# EAGLE schematic hw_Stencil_IMX296 (EAGLE 7.6.0)
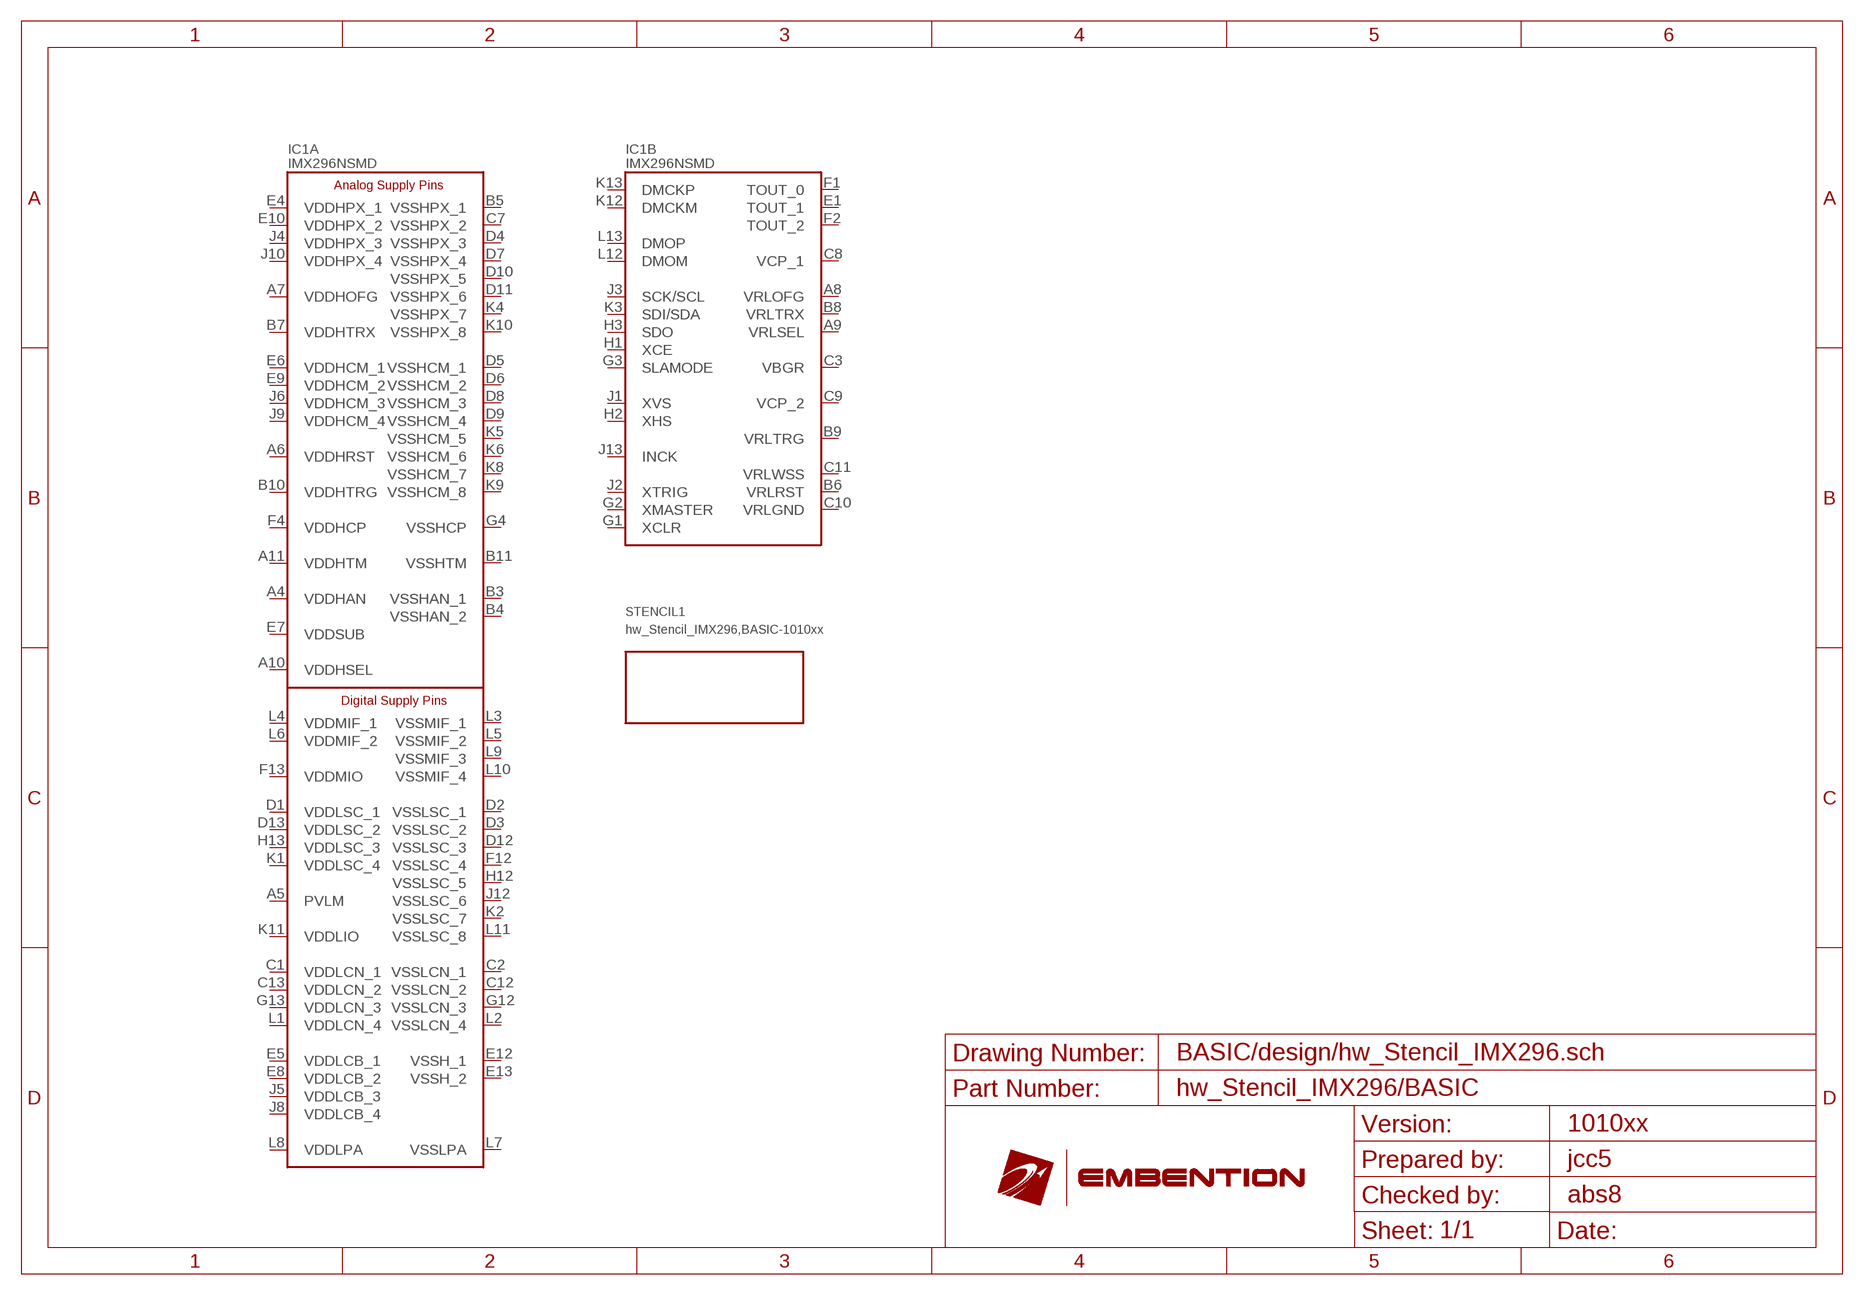
[diagram p0: schematic, sheet 1]

## Parts
IC1  IMX296NSMD  [LGA-138_NSMD]
STENCIL1  hw_Stencil_IMX296,BASIC-1010xx  EXTERNAL-PCB-COMPONENTS  [VOID]
Unconnected: IC1.A1(C:NC_1) IC1.A3(C:NC_2) IC1.A4(A:VDDHAN) IC1.A5(A:PVLM) IC1.A6(A:VDDHRST) IC1.A7(A:VDDHOFG) IC1.A8(B:VRLOFG) IC1.A9(B:VRLSEL) IC1.A10(A:VDDHSEL) IC1.A11(A:VDDHTM) IC1.A13(C:NC_3) IC1.B3(A:VSSHAN_1) IC1.B4(A:VSSHAN_2) IC1.B5(A:VSSHPX_1) IC1.B6(B:VRLRST) IC1.B7(A:VDDHTRX) IC1.B8(B:VRLTRX) IC1.B9(B:VRLTRG) IC1.B10(A:VDDHTRG) IC1.B11(A:VSSHTM) IC1.C1(A:VDDLCN_1) IC1.C2(A:VSSLCN_1) IC1.C3(B:VBGR) IC1.C4(C:NC_4) IC1.C5(C:NC_5) IC1.C6(C:NC_6) IC1.C7(A:VSSHPX_2) IC1.C8(B:VCP_1) IC1.C9(B:VCP_2) IC1.C10(B:VRLGND) IC1.C11(B:VRLWSS) IC1.C12(A:VSSLCN_2) IC1.C13(A:VDDLCN_2) IC1.D1(A:VDDLSC_1) IC1.D2(A:VSSLSC_1) IC1.D3(A:VSSLSC_2) IC1.D4(A:VSSHPX_3) IC1.D5(A:VSSHCM_1) IC1.D6(A:VSSHCM_2) IC1.D7(A:VSSHPX_4) IC1.D8(A:VSSHCM_3) IC1.D9(A:VSSHCM_4) IC1.D10(A:VSSHPX_5) IC1.D11(A:VSSHPX_6) IC1.D12(A:VSSLSC_3) IC1.D13(A:VDDLSC_2) IC1.E1(B:TOUT_1) IC1.E2(C:NC_7) IC1.E3(C:NC_8) IC1.E4(A:VDDHPX_1) IC1.E5(A:VDDLCB_1) IC1.E6(A:VDDHCM_1) IC1.E7(A:VDDSUB) IC1.E8(A:VDDLCB_2) IC1.E9(A:VDDHCM_2) IC1.E10(A:VDDHPX_2) IC1.E11(C:NC_9) IC1.E12(A:VSSH_1) IC1.E13(A:VSSH_2) IC1.F1(B:TOUT_0) IC1.F2(B:TOUT_2) IC1.F3(C:NC_10) IC1.F4(A:VDDHCP) IC1.F10(C:NC_11) IC1.F11(C:NC_12) IC1.F12(A:VSSLSC_4) IC1.F13(A:VDDMIO) IC1.G1(B:XCLR) IC1.G2(B:XMASTER) IC1.G3(B:SLAMODE) IC1.G4(A:VSSHCP) IC1.G10(C:NC_13) IC1.G11(C:NC_14) IC1.G12(A:VSSLCN_3) IC1.G13(A:VDDLCN_3) IC1.H1(B:XCE) IC1.H2(B:XHS) IC1.H3(B:SDO) IC1.H4(C:NC_15) IC1.H10(C:NC_16) IC1.H11(C:NC_17) IC1.H12(A:VSSLSC_5) IC1.H13(A:VDDLSC_3) IC1.J1(B:XVS) IC1.J2(B:XTRIG) IC1.J3(B:SCK/SCL) IC1.J4(A:VDDHPX_3) IC1.J5(A:VDDLCB_3) IC1.J6(A:VDDHCM_3) IC1.J7(C:NC_18) IC1.J8(A:VDDLCB_4) IC1.J9(A:VDDHCM_4) IC1.J10(A:VDDHPX_4) IC1.J11(C:NC_19) IC1.J12(A:VSSLSC_6) IC1.J13(B:INCK) IC1.K1(A:VDDLSC_4) IC1.K2(A:VSSLSC_7) IC1.K3(B:SDI/SDA) IC1.K4(A:VSSHPX_7) IC1.K5(A:VSSHCM_5) IC1.K6(A:VSSHCM_6) IC1.K7(C:NC_20) IC1.K8(A:VSSHCM_7) IC1.K9(A:VSSHCM_8) IC1.K10(A:VSSHPX_8) IC1.K11(A:VDDLIO) IC1.K12(B:DMCKM) IC1.K13(B:DMCKP) IC1.L1(A:VDDLCN_4) IC1.L2(A:VSSLCN_4) IC1.L3(A:VSSMIF_1) IC1.L4(A:VDDMIF_1) IC1.L5(A:VSSMIF_2) IC1.L6(A:VDDMIF_2) IC1.L7(A:VSSLPA) IC1.L8(A:VDDLPA) IC1.L9(A:VSSMIF_3) IC1.L10(A:VSSMIF_4) IC1.L11(A:VSSLSC_8) IC1.L12(B:DMOM) IC1.L13(B:DMOP) IC1.M3(C:NC_21) IC1.M4(C:NC_22) IC1.M5(C:NC_23) IC1.M6(C:NC_24) IC1.M7(C:NC_25) IC1.M8(C:NC_26) IC1.M9(C:NC_27) IC1.M10(C:NC_28) IC1.M11(C:NC_29) IC1.N1(C:NC_30) IC1.N3(C:NC_31) IC1.N4(C:NC_32) IC1.N5(C:NC_33) IC1.N6(C:NC_34) IC1.N7(C:NC_35) IC1.N8(C:NC_36) IC1.N9(C:NC_37) IC1.N10(C:NC_38) IC1.N11(C:NC_39) IC1.N13(C:NC_40)

## Notes on the sheet
- BASIC/design/hw_Stencil_IMX296.sch
- hw_Stencil_IMX296/BASIC
- 1010xx
- jcc5
- abs8

## Library data of the parts
IC1 = emb-IC:IMX296: IMX290LQR-C CMOS Solid-state Image Sensor with Square Pixel for Color Cameras Package/Case: LGA-138 Interface: MIPI (2-lanes) ans I2C Imagen Resolution: 1440x1080 ADC Converter: 10bit
STENCIL1 = emb-Others:EXTERNAL-PCB-COMPONENTS: PCB symbol for board BOM; PNS: OTHER-hw_Stencil_IMX296,BASIC-1010xx.pns

## Net classes
1 DIFF100: width 0.075 mm
2 60V: clearance 0.15 mm